# EAGLE schematic powerlolu (EAGLE 6.2)
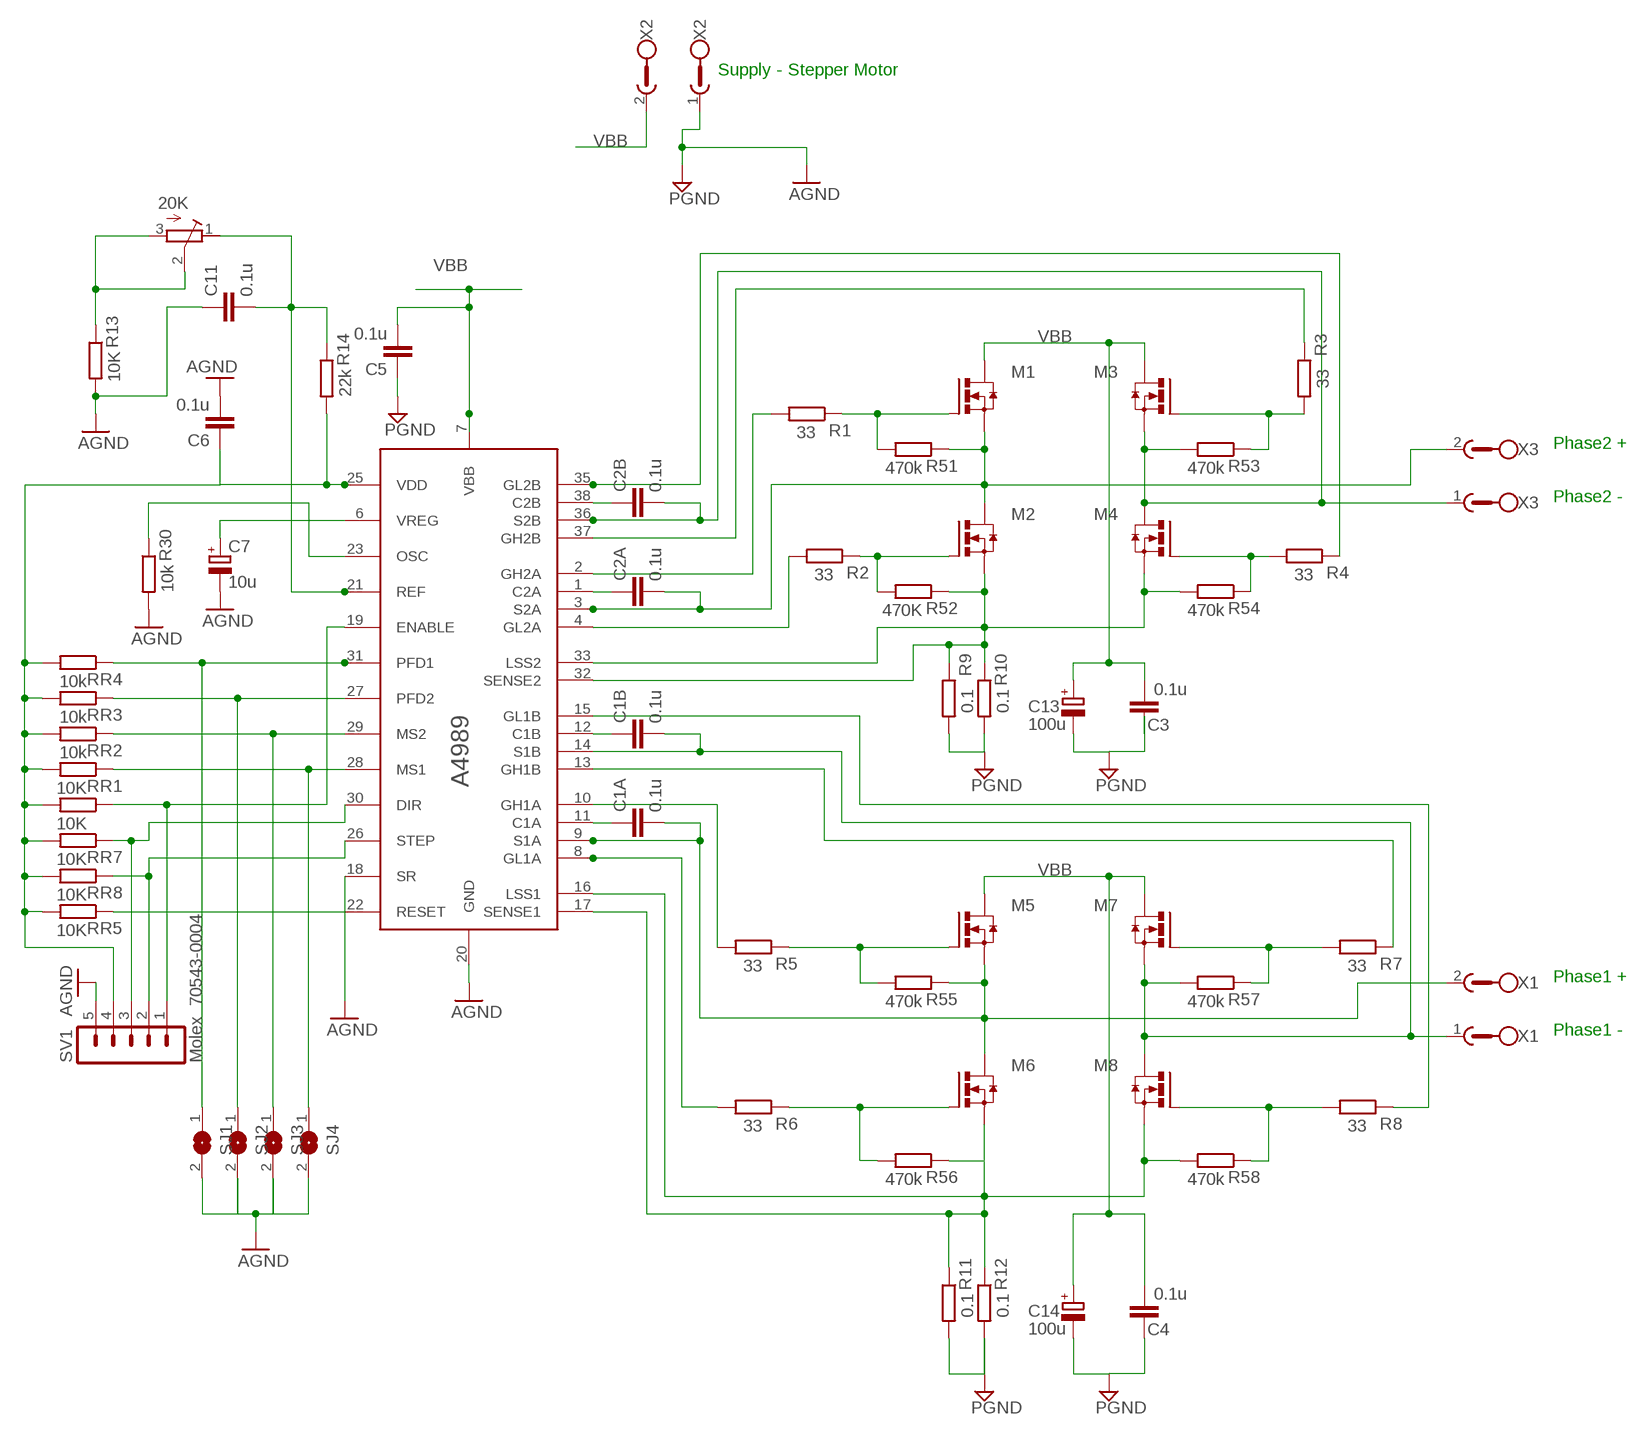
[diagram p0: schematic, sheet 1]

## Parts
A4989  A4989  [TSSOP39]
C1A  0.1u  C-EUC0603  [C0603]
C1B  0.1u  C-EUC0603  [C0603]
C2A  0.1u  C-EUC0603  [C0603]
C2B  0.1u  C-EUC0603  [C0603]
C3  0.1u  C-EUC0603  [C0603]
C4  0.1u  C-EUC0603  [C0603]
C5  0.1u  C-EUC0603  [C0603]
C6  0.1u  C-EUC0603  [C0603]
C7  10u  CPOL-EU153CLV-0605  [153CLV-0605]
C11  0.1u  C-EUC0603  [C0603]
C13  100u  CPOL-EUE5-10.5  [E5-10,5]
C14  100u  CPOL-EUE5-10.5  [E5-10,5]
M1  IRLR024N  [TO252]
M2  IRLR024N  [TO252]
M3  IRLR024N  [TO252]
M4  IRLR024N  [TO252]
M5  IRLR024N  [TO252]
M6  IRLR024N  [TO252]
M7  IRLR024N  [TO252]
M8  IRLR024N  [TO252]
R1  33  R-EU_R0603  [R0603]
R2  33  R-EU_R0603  [R0603]
R3  33  R-EU_R0603  [R0603]
R4  33  R-EU_R0603  [R0603]
R5  33  R-EU_R0603  [R0603]
R6  33  R-EU_R0603  [R0603]
R7  33  R-EU_R0603  [R0603]
R8  33  R-EU_R0603  [R0603]
R9  0.1  R-EU_R2512  [R2512]
R10  0.1  R-EU_R2512  [R2512]
R11  0.1  R-EU_R2512  [R2512]
R12  0.1  R-EU_R2512  [R2512]
R13  10K  R-EU_R0603  [R0603]
R14  22k  R-EU_R0603  [R0603]
R30  10k  R-EU_R0603  [R0603]
R51  470k  R-EU_R0603  [R0603]
R52  470K  R-EU_R0603  [R0603]
R53  470k  R-EU_R0603  [R0603]
R54  470k  R-EU_R0603  [R0603]
R55  470k  R-EU_R0603  [R0603]
R56  470k  R-EU_R0603  [R0603]
R57  470k  R-EU_R0603  [R0603]
R58  470k  R-EU_R0603  [R0603]
RR1  10K  R-EU_R0603  [R0603]
RR2  10k  R-EU_R0603  [R0603]
RR3  10k  R-EU_R0603  [R0603]
RR4  10k  R-EU_R0603  [R0603]
RR5  10K  R-EU_R0603  [R0603]
RR6  10K  R-EU_R0603  [R0603]
RR7  10K  R-EU_R0603  [R0603]
RR8  10K  R-EU_R0603  [R0603]
SJ1  SJ  [SJ]
SJ2  SJ  [SJ]
SJ3  SJ  [SJ]
SJ4  SJ  [SJ]
SV1  Molex 70543-0004  MA05-1  [MA05-1]
U$1  20K  BOURNS_TRIMMER_3266W  [BOURNS_3266W]
X1  GMGDS32  [GMKDS32]
X2  GMGDS32  [GMKDS32]
X3  GMGDS32  [GMKDS32]

## Nets
GND: A4989.18(SR) A4989.20(GND) C3.1 C4.1 C5.1 C6.2 C7.- C11.1 C13.- C14.- R9.2 R10.2 R11.2 R12.2 R13.2 R30.2 SJ1.2 SJ2.2 SJ3.2 SJ4.2 SV1.5 X2.1 ; supply symbol labelled PGND, AGND
N$1: A4989.27(PFD2) RR3.1 SJ2.1
N$2: A4989.29(MS2) RR2.1 SJ3.1
N$3: A4989.28(MS1) RR1.1 SJ4.1
N$6: M2.1(G) R2.1 R52.2
N$7: M1.1(G) R1.1 R51.2
N$8: M3.1(G) R3.2 R53.1
N$9: M4.1(G) R4.2 R54.1
N$10: M6.1(G) R6.1 R56.2
N$11: M5.1(G) R5.1 R55.2
N$12: M7.1(G) R7.2 R57.1
N$13: M8.1(G) R8.2 R58.1
N$15: A4989.23(OSC) R30.1
N$16: R13.1 U$1.2(S) U$1.3(E)
N$18: A4989.22(RESET) RR5.1
N$19: A4989.21(REF) C11.2 R14.1 U$1.1(A)
N$20: A4989.37(GH2B) R3.1
N$21: A4989.2(GH2A) R1.2
N$22: A4989.35(GL2B) R4.1
N$23: A4989.4(GL2A) R2.2
N$24: A4989.26(STEP) RR8.1 SV1.2
N$25: A4989.32(SENSE2) A4989.33(LSS2) M2.2(S) M4.2(S) R9.1 R10.1 R52.1 R54.2
N$26: A4989.19(ENABLE) RR6.1 SV1.1
N$27: A4989.10(GH1A) R5.2
N$28: A4989.13(GH1B) R7.1
N$29: A4989.15(GL1B) R8.1
N$30: A4989.8(GL1A) R6.2
N$31: A4989.12(C1B) C1B.1
N$32: A4989.16(LSS1) A4989.17(SENSE1) M6.2(S) M8.2(S) R11.1 R12.1 R56.1 R58.2
N$33: A4989.31(PFD1) RR4.1 SJ1.1
N$34: A4989.11(C1A) C1A.1
N$35: A4989.1(C2A) C2A.1
N$36: A4989.38(C2B) C2B.1
N$37: A4989.30(DIR) RR7.1 SV1.3
N$38: A4989.25(VDD) C6.1 R14.2 RR1.2 RR2.2 RR3.2 RR4.2 RR5.2 RR6.2 RR7.2 RR8.2 SV1.4
N$39: A4989.6(VREG) C7.+
P1+: A4989.9(S1A) C1A.2 M5.2(S) M6.3(D) R55.1 X1.2
P1-: A4989.14(S1B) C1B.2 M7.2(S) M8.3(D) R57.2 X1.1
P2+: A4989.3(S2A) C2A.2 M1.2(S) M2.3(D) R51.1 X3.2
P2-: A4989.36(S2B) C2B.2 M3.2(S) M4.3(D) R53.2 X3.1
VBB: A4989.7(VBB) C3.2 C4.2 C5.2 C13.+ C14.+ M1.3(D) M3.3(D) M5.3(D) M7.3(D) X2.2

## Notes on the sheet
- Supply - Stepper Motor
- Phase2 +
- Phase2 -
- Phase1 +
- Phase1 -

## Library data of the parts
A4989 = myLib:A4989
C1A C1B C2A C2B C3-C6 C11 = resistor:C-EU: CAPACITOR, European symbol
C7 C13 C14 = rcl:CPOL-EU: POLARIZED CAPACITOR, European symbol
M1-M8 = to252(1):IRLR024N
R1-R14 R30 R51-R58 RR1-RR8 = resistor:R-EU_: RESISTOR, European symbol
SJ1-SJ4 = jumper:SJ: SMD solder JUMPER
SV1 = con-lstb:MA05-1: PIN HEADER; OC_FARNELL: unknown; OC_NEWARK: unknown
U$1 = myLib:BOURNS_TRIMMER_3266W
X1-X3 = myLib:GMGDS32